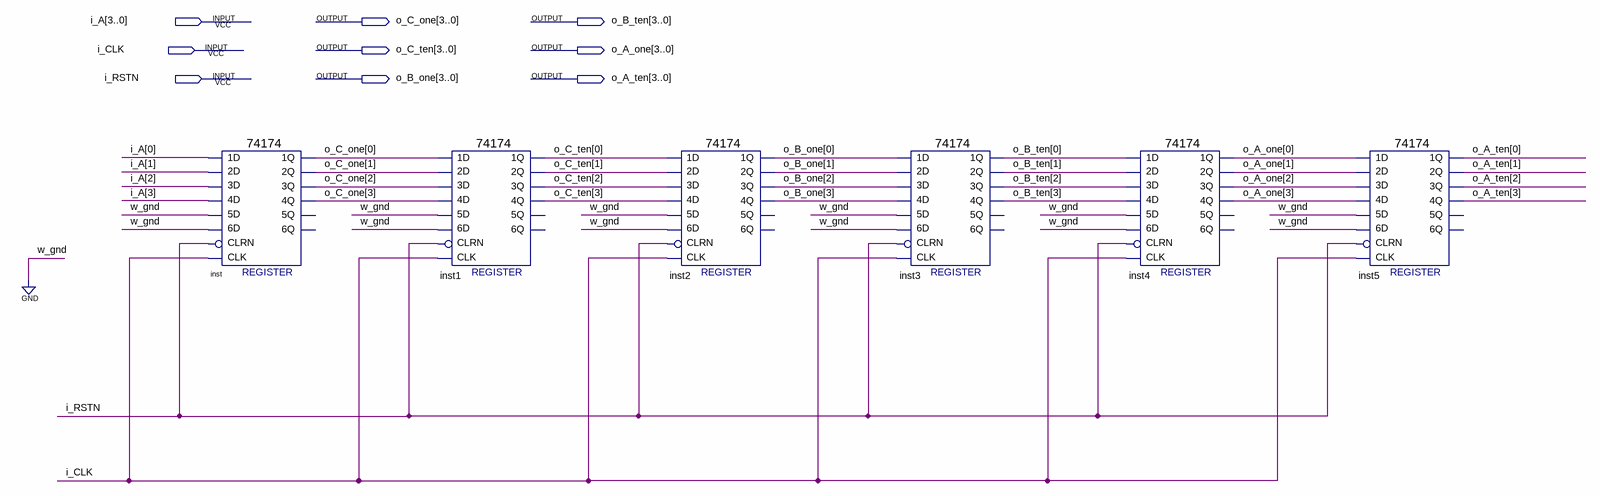
[diagram p0: schematic sheet]
// Quartus schematic shift_3_bcd.bdf as structural Verilog: 6 symbols, 9 pins
module shift_3_bcd (
  input  [3:0] i_A,
  input  i_CLK,
  input  i_RSTN,
  output [3:0] o_C_one,
  output [3:0] o_B_ten,
  output [3:0] o_C_ten,
  output [3:0] o_A_one,
  output [3:0] o_B_one,
  output [3:0] o_A_ten
);

  \74174  inst (
    .\4D (i_A[3]), .\3D (i_A[2]), .\5D (1'b0), .\6D (1'b0), .CLK(i_CLK), .CLRN(i_RSTN), .\1D (i_A[0]),
    .\2D (i_A[1]), .\1Q (o_C_one[0]), .\4Q (o_C_one[3]), .\3Q (o_C_one[2]), .\2Q (o_C_one[1]));  // open: 6Q, 5Q
  \74174  inst1 (
    .\4D (o_C_one[3]), .\3D (o_C_one[2]), .\5D (1'b0), .\6D (1'b0), .CLK(i_CLK), .CLRN(i_RSTN),
    .\1D (o_C_one[0]), .\2D (o_C_one[1]), .\1Q (o_C_ten[0]), .\4Q (o_C_ten[3]), .\3Q (o_C_ten[2]),
    .\2Q (o_C_ten[1]));  // open: 6Q, 5Q
  \74174  inst2 (
    .\4D (o_C_ten[3]), .\3D (o_C_ten[2]), .\5D (1'b0), .\6D (1'b0), .CLK(i_CLK), .CLRN(i_RSTN),
    .\1D (o_C_ten[0]), .\2D (o_C_ten[1]), .\1Q (o_B_one[0]), .\4Q (o_B_one[3]), .\3Q (o_B_one[2]),
    .\2Q (o_B_one[1]));  // open: 6Q, 5Q
  \74174  inst3 (
    .\4D (o_B_one[3]), .\3D (o_B_one[2]), .\5D (1'b0), .\6D (1'b0), .CLK(i_CLK), .CLRN(i_RSTN),
    .\1D (o_B_one[0]), .\2D (o_B_one[1]), .\1Q (o_B_ten[0]), .\4Q (o_B_ten[3]), .\3Q (o_B_ten[2]),
    .\2Q (o_B_ten[1]));  // open: 6Q, 5Q
  \74174  inst4 (
    .\4D (o_B_ten[3]), .\3D (o_B_ten[2]), .\5D (1'b0), .\6D (1'b0), .CLK(i_CLK), .CLRN(i_RSTN),
    .\1D (o_B_ten[0]), .\2D (o_B_ten[1]), .\1Q (o_A_one[0]), .\4Q (o_A_one[3]), .\3Q (o_A_one[2]),
    .\2Q (o_A_one[1]));  // open: 6Q, 5Q
  \74174  inst5 (
    .\4D (o_A_one[3]), .\3D (o_A_one[2]), .\5D (1'b0), .\6D (1'b0), .CLK(i_CLK), .CLRN(i_RSTN),
    .\1D (o_A_one[0]), .\2D (o_A_one[1]), .\1Q (o_A_ten[0]), .\4Q (o_A_ten[3]), .\3Q (o_A_ten[2]),
    .\2Q (o_A_ten[1]));  // open: 6Q, 5Q
endmodule
